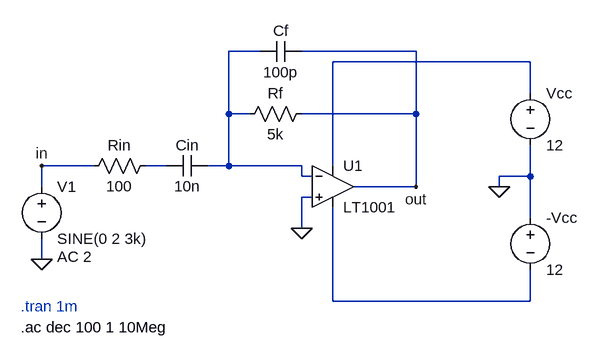
[diagram p0: schematic differentiator.asc]
differentiator.asc, the LTspice schematic file:
Version 4.1
SHEET 1 880 680
WIRE 96 -32 48 -32
WIRE 336 -32 160 -32
WIRE 512 -16 208 -16
WIRE 512 32 512 -16
WIRE 48 64 48 -32
WIRE 80 64 48 64
WIRE 336 64 336 -32
WIRE 336 64 160 64
WIRE -160 144 -240 144
WIRE -48 144 -80 144
WIRE 48 144 48 64
WIRE 48 144 16 144
WIRE 160 144 48 144
WIRE 208 144 208 -16
WIRE 160 160 160 144
WIRE 176 160 160 160
WIRE 512 160 512 112
WIRE 512 160 464 160
WIRE -240 176 -240 144
WIRE 336 176 336 64
WIRE 336 176 240 176
WIRE 464 176 464 160
WIRE 176 192 160 192
WIRE 512 224 512 160
WIRE 160 240 160 192
WIRE -240 288 -240 256
WIRE 208 352 208 208
WIRE 512 352 512 304
WIRE 512 352 208 352
FLAG 160 240 0
FLAG -240 288 0
FLAG 336 176 out
FLAG -240 144 in
FLAG 464 176 0
SYMBOL OpAmps\\LT1001 208 112 R0
SYMATTR InstName U1
SYMBOL res -64 128 R90
WINDOW 0 0 56 VBottom 2
WINDOW 3 32 56 VTop 2
SYMATTR InstName Rin
SYMATTR Value 100
SYMBOL res 176 48 R90
WINDOW 0 0 56 VBottom 2
WINDOW 3 32 56 VTop 2
SYMATTR InstName Rf
SYMATTR Value 5k
SYMBOL cap 16 128 R90
WINDOW 0 0 32 VBottom 2
WINDOW 3 32 32 VTop 2
SYMATTR InstName Cin
SYMATTR Value 10n
SYMBOL cap 160 -48 R90
WINDOW 0 0 32 VBottom 2
WINDOW 3 32 32 VTop 2
SYMATTR InstName Cf
SYMATTR Value 100p
SYMBOL voltage -240 160 R0
WINDOW 123 24 124 Left 2
WINDOW 39 0 0 Left 0
SYMATTR InstName V1
SYMATTR Value SINE(0 2 3k)
SYMATTR Value2 AC 2
SYMBOL voltage 512 16 R0
WINDOW 123 0 0 Left 0
WINDOW 39 0 0 Left 0
SYMATTR InstName Vcc
SYMATTR Value 12
SYMBOL voltage 512 208 R0
WINDOW 123 0 0 Left 0
WINDOW 39 0 0 Left 0
SYMATTR InstName -Vcc
SYMATTR Value 12
TEXT -272 360 Left 2 ;.tran 1m
TEXT -272 392 Left 2 !.ac dec 100 1 10Meg

The netlist it stands for:
* differentiator.asc
X§U1 0 N001 N002 N004 out LT1001  ; pins In+ In- V+ V- OUT
Rin N003 in 100
Rf out N001 5k
Cin N001 N003 10n
Cf out N001 100p
V1 in 0 SINE(0 2 3k) AC 2
Vcc N002 0 12
V§-Vcc 0 N004 12
* .tran 1m
.ac dec 100 1 10Meg
.lib LTC.lib
.backanno
.end